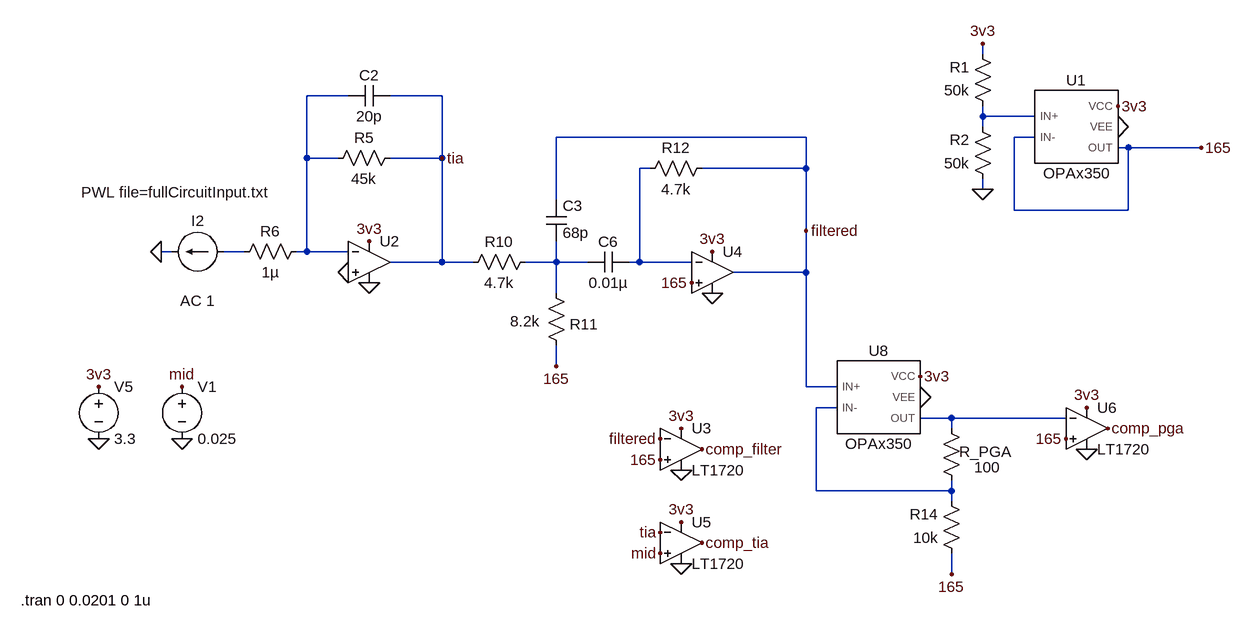
[diagram p0: schematic circuit_onlyPGA.asc]
circuit_onlyPGA.asc, the LTspice schematic file:
Version 4.1
SHEET 1 1996 1696
WIRE 976 736 976 720
WIRE 0 800 -64 800
WIRE 144 800 64 800
WIRE 976 832 976 816
WIRE 1056 832 976 832
WIRE 976 848 976 832
WIRE 704 864 320 864
WIRE 1056 864 1024 864
WIRE 1200 880 1184 880
WIRE 1312 880 1200 880
WIRE -64 896 -64 800
WIRE -16 896 -64 896
WIRE 144 896 144 800
WIRE 144 896 64 896
WIRE 464 912 448 912
WIRE 704 912 704 864
WIRE 704 912 544 912
WIRE 976 944 976 928
WIRE 320 960 320 864
WIRE 1024 976 1024 864
WIRE 1200 976 1200 880
WIRE 1200 976 1024 976
WIRE 704 1008 704 912
WIRE -272 1040 -288 1040
WIRE -160 1040 -192 1040
WIRE -64 1040 -64 896
WIRE -64 1040 -80 1040
WIRE 0 1040 -64 1040
WIRE 144 1056 144 896
WIRE 144 1056 64 1056
WIRE 192 1056 144 1056
WIRE 320 1056 320 1024
WIRE 320 1056 272 1056
WIRE 368 1056 320 1056
WIRE 448 1056 448 912
WIRE 448 1056 432 1056
WIRE 528 1056 448 1056
WIRE 704 1072 704 1008
WIRE 704 1072 592 1072
WIRE 320 1104 320 1056
WIRE 320 1216 320 1184
WIRE 704 1248 704 1072
WIRE 752 1248 704 1248
WIRE 752 1280 720 1280
WIRE 928 1296 880 1296
WIRE 1104 1296 928 1296
WIRE 928 1312 928 1296
WIRE 720 1408 720 1280
WIRE 928 1408 928 1392
WIRE 928 1408 720 1408
WIRE 928 1424 928 1408
WIRE 928 1536 928 1504
FLAG 32 1024 3v3
FLAG 32 1088 0
FLAG -288 1040 0
FLAG 560 1040 3v3
FLAG 560 1104 0
FLAG 704 1008 filtered
FLAG -384 1328 0
FLAG -384 1248 3v3
FLAG 320 1216 165
FLAG 528 1088 165
FLAG 928 1536 165
FLAG 480 1328 filtered
FLAG 544 1344 comp_filter
FLAG 0 1072 0
FLAG 480 1360 165
FLAG 512 1312 3v3
FLAG 512 1376 0
FLAG 544 1488 comp_tia
FLAG 512 1456 3v3
FLAG 512 1520 0
FLAG 480 1504 mid
FLAG 144 896 tia
FLAG 480 1472 tia
FLAG -256 1328 0
FLAG -256 1248 mid
FLAG 976 720 3v3
FLAG 976 944 0
FLAG 1184 848 0
FLAG 1184 816 3v3
FLAG 1312 880 165
FLAG 880 1264 0
FLAG 880 1232 3v3
FLAG 1168 1312 comp_pga
FLAG 1104 1328 165
FLAG 1136 1280 3v3
FLAG 1136 1344 0
SYMBOL res 80 880 R90
WINDOW 0 0 56 VBottom 2
WINDOW 3 32 56 VTop 2
SYMATTR InstName R5
SYMATTR Value 45k
SYMBOL cap 64 784 R90
WINDOW 0 0 32 VBottom 2
WINDOW 3 32 32 VTop 2
SYMATTR InstName C2
SYMATTR Value 20p
SYMBOL res -64 1024 R90
WINDOW 0 0 56 VBottom 2
WINDOW 3 32 56 VTop 2
SYMATTR InstName R6
SYMATTR Value 1µ
SYMBOL current -192 1040 R90
WINDOW 0 -32 40 VBottom 2
WINDOW 3 -107 75 VTop 2
WINDOW 123 60 40 VTop 2
WINDOW 39 0 0 Left 0
SYMATTR InstName I2
SYMATTR Value PWL file=fullCircuitInput.txt
SYMATTR Value2 AC 1
SYMBOL res 288 1040 R90
WINDOW 0 0 56 VBottom 2
WINDOW 3 32 56 VTop 2
SYMATTR InstName R10
SYMATTR Value 4.7k
SYMBOL res 336 1200 R180
WINDOW 0 -49 48 Left 2
WINDOW 3 41 53 Left 2
SYMATTR InstName R11
SYMATTR Value 8.2k
SYMBOL cap 304 960 R0
WINDOW 0 26 9 Left 2
WINDOW 3 26 51 Left 2
SYMATTR InstName C3
SYMATTR Value 68p
SYMBOL cap 432 1040 R90
WINDOW 0 0 32 VBottom 2
WINDOW 3 32 32 VTop 2
SYMATTR InstName C6
SYMATTR Value 0.01µ
SYMBOL res 560 896 R90
WINDOW 0 0 56 VBottom 2
WINDOW 3 32 56 VTop 2
SYMATTR InstName R12
SYMATTR Value 4.7k
SYMBOL voltage -384 1232 R0
WINDOW 123 0 0 Left 0
WINDOW 39 0 0 Left 0
SYMATTR InstName V5
SYMATTR Value 3.3
SYMBOL res 944 1408 R180
WINDOW 0 -77 60 Left 2
WINDOW 3 -59 36 Left 2
SYMATTR InstName R_PGA
SYMATTR Value 100
SYMBOL res 944 1520 R180
WINDOW 0 36 76 Left 2
WINDOW 3 36 40 Left 2
SYMATTR InstName R14
SYMATTR Value 10k
SYMBOL Comparators\\LT1720 512 1280 R0
SYMATTR InstName U3
SYMBOL Comparators\\LT1720 512 1424 R0
SYMATTR InstName U5
SYMBOL OpAmps\\UniversalOpAmp2 32 1056 R0
SYMATTR InstName U2
SYMBOL OpAmps\\UniversalOpAmp2 560 1072 R0
SYMATTR InstName U4
SYMBOL voltage -256 1232 R0
WINDOW 123 0 0 Left 0
WINDOW 39 0 0 Left 0
SYMATTR InstName V1
SYMATTR Value 0.025
SYMBOL LTSpiceModels\\sbom071e\\OPAx350 816 1264 R0
SYMATTR InstName U8
SYMBOL LTSpiceModels\\sbom071e\\OPAx350 1120 848 R0
SYMATTR InstName U1
SYMBOL res 992 832 R180
WINDOW 0 36 76 Left 2
WINDOW 3 36 40 Left 2
SYMATTR InstName R1
SYMATTR Value 50k
SYMBOL res 992 944 R180
WINDOW 0 36 76 Left 2
WINDOW 3 36 40 Left 2
SYMATTR InstName R2
SYMATTR Value 50k
SYMBOL Comparators\\LT1720 1136 1248 R0
SYMATTR InstName U6
TEXT -504 1576 Left 2 !.tran 0 0.0201 0 1u

The netlist it stands for:
* circuit_onlyPGA.asc
R5 tia N001 45k
C2 tia N001 20p
R6 N001 N004 1µ
I2 N004 0 PWL file=fullCircuitInput.txt AC 1
R10 N005 tia 4.7k
R11 165 N005 8.2k
C3 filtered N005 68p
C6 N003 N005 0.01µ
R12 filtered N003 4.7k
V5 3v3 0 3.3
R_PGA N006 N007 100
R14 165 N006 10k
X§U3 165 filtered 3v3 0 comp_filter LT1720  ; pins In+ In- V+ V- OUT
X§U5 mid tia 3v3 0 comp_tia LT1720  ; pins In+ In- V+ V- OUT
X§U2 0 N001 3v3 0 tia level2 Avol=1Meg GBW=10Meg Slew=10Meg Ilimit=25m Rail=0 Vos=0 En=0 Enk=0 In=0 Ink=0 Rin=500Meg  ; pins In+ In- V+ V- OUT
X§U4 165 N003 3v3 0 filtered level2 Avol=1Meg GBW=10Meg Slew=10Meg Ilimit=25m Rail=0 Vos=0 En=0 Enk=0 In=0 Ink=0 Rin=500Meg  ; pins In+ In- V+ V- OUT
V1 mid 0 0.025
X§U8 filtered N006 3v3 0 N007 OPAx350  ; pins IN+ IN- VCC VEE OUT
X§U1 N002 165 3v3 0 165 OPAx350  ; pins IN+ IN- VCC VEE OUT
R1 N002 3v3 50k
R2 0 N002 50k
X§U6 165 N007 3v3 0 comp_pga LT1720  ; pins In+ In- V+ V- OUT
.tran 0 0.0201 0 1u
.lib LT1720.sub
.lib UniversalOpAmp2.lib
.lib C:\Users\jpulu\OneDrive\Área de Trabalho\TCC\LTSpiceModels\sbom071e\OPAx350.LIB
.backanno
.end